# EAGLE schematic Main (EAGLE 7.7.0)
AUTHOR: Thomas D'Agostino; REV: 0.5

## Sheet 1 of 6: Control Input Protection
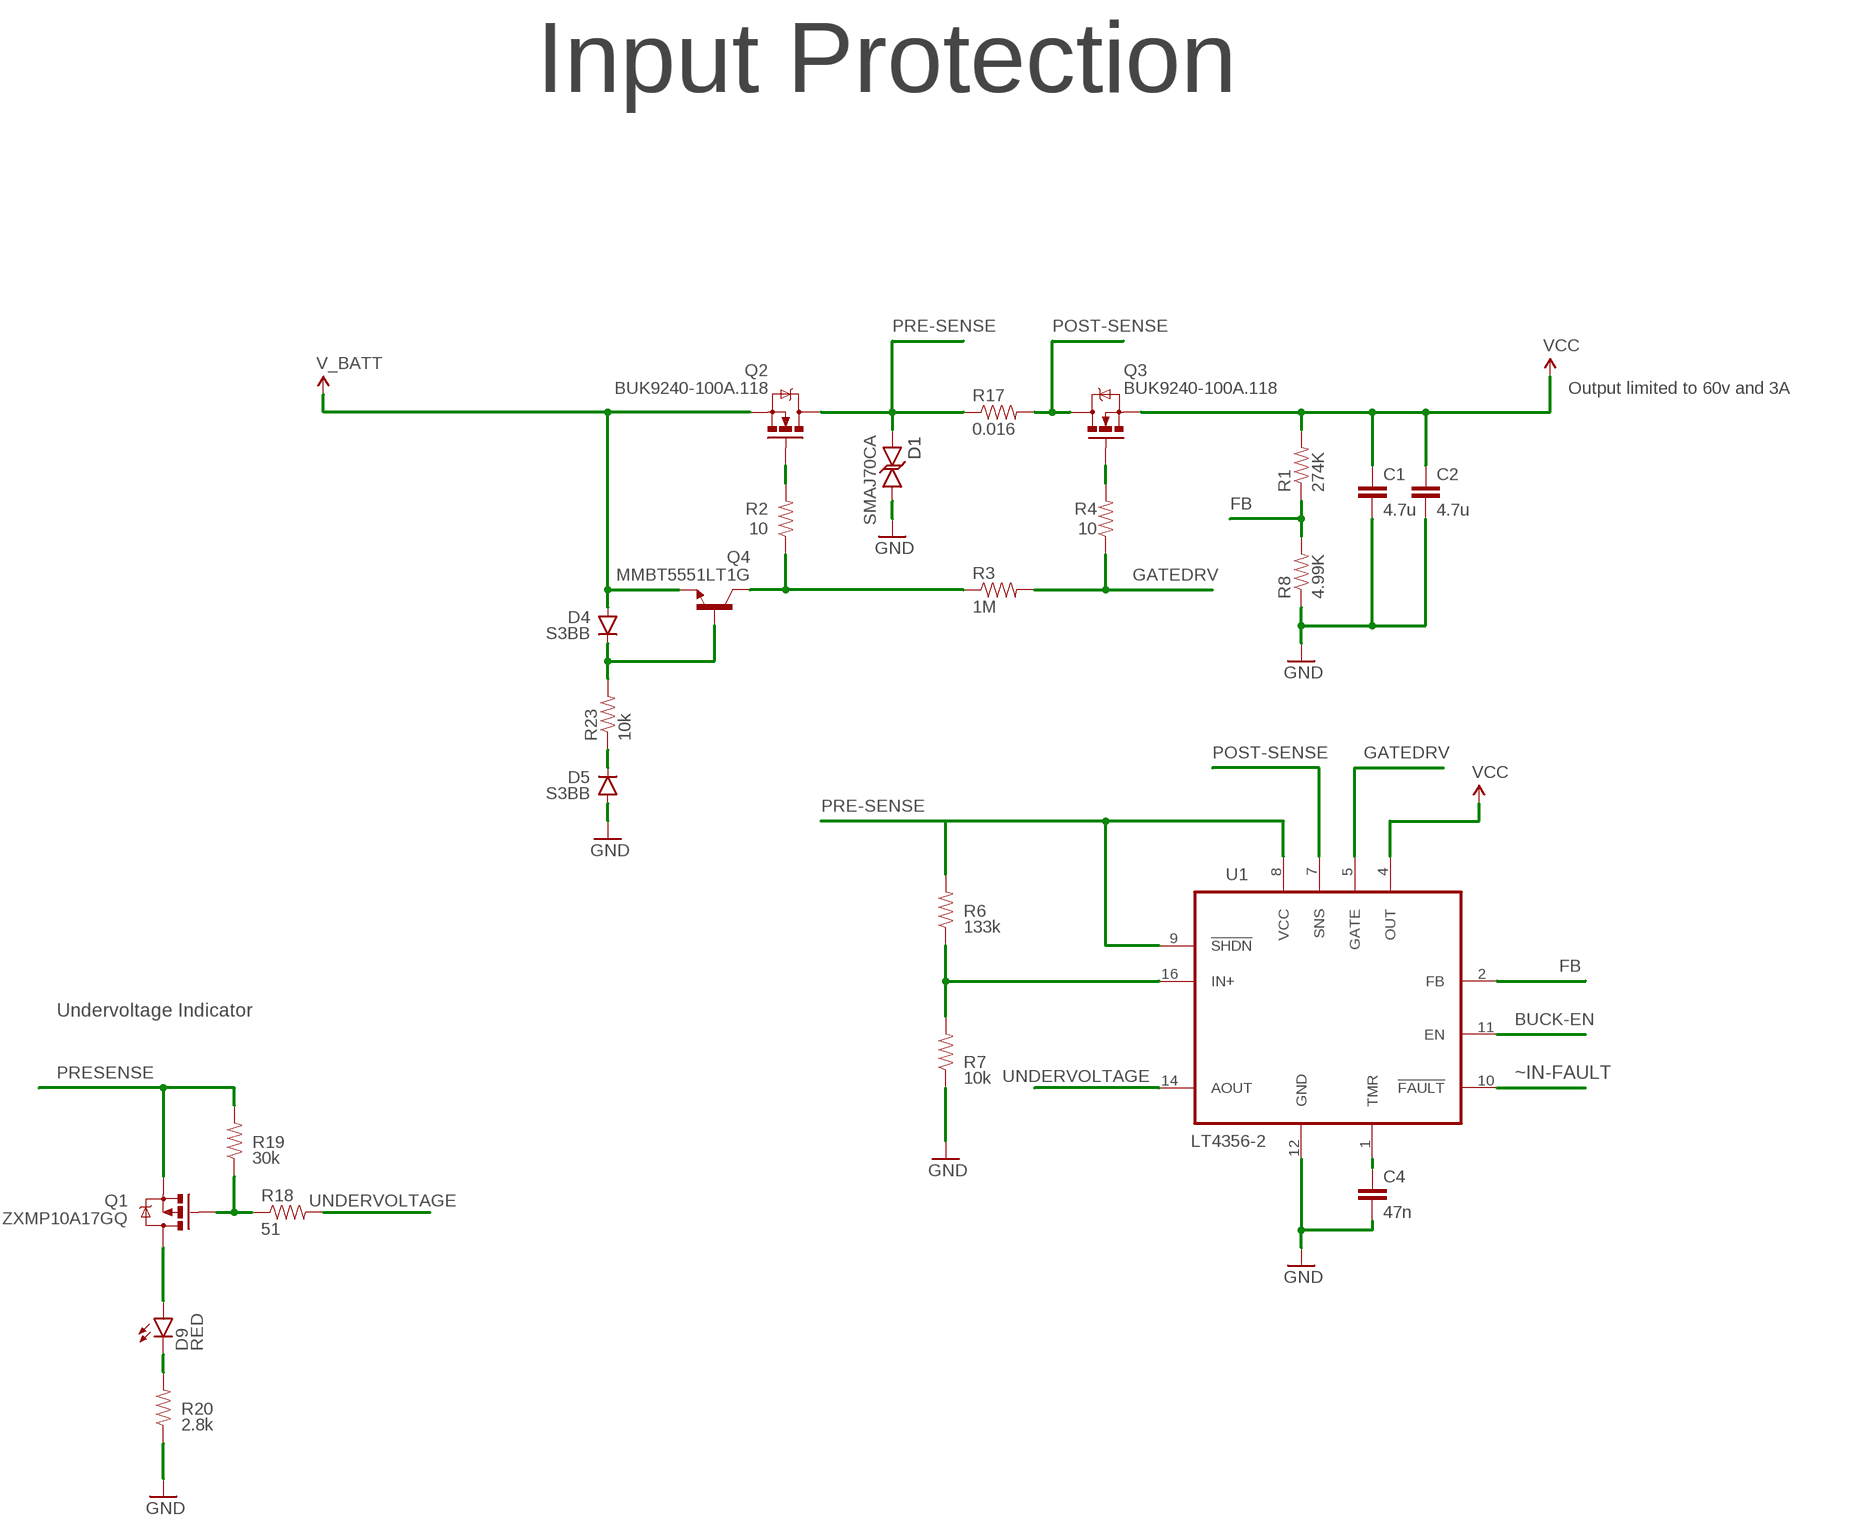
[diagram p0: schematic, sheet 1]

### Parts
C1  4.7u  CAP1210  [1210]
C2  4.7u  CAP1210  [1210]
C4  47n  CAP0805  [0805]
D1  SMAJ70CA  [SMA-DIODE]
D4  S3BB  DIODES3BB  [SMB-DIODE]
D5  S3BB  DIODES3BB  [SMB-DIODE]
D9  RED  LED-RED1206  [LED-1206]
Q1  ZXMP10A17GQ  MOSFET-PCHANNELZXMP10A17GQ  [SOT223]
Q2  BUK9240-100A.118  MOSFET-NCHANNELBUK9240-100A.118  [DPAK]
Q3  BUK9240-100A.118  MOSFET-NCHANNELBUK9240-100A.118  [DPAK]
Q4  MMBT5551LT1G  TRANSISTOR_NPNMMBT5551LT1G  [SOT23-3]
R1  274K  RESISTOR1206  [1206]
R2  10  RESISTOR1206  [1206]
R3  1M  RESISTOR0805-RES  [0805]
R4  10  RESISTOR0805-RES  [0805]
R6  133k  RESISTOR0805-RES  [0805]
R7  10k  RESISTOR0805-RES  [0805]
R8  4.99K  RESISTOR1206  [1206]
R17  0.016  RESISTOR2010  [R2010]
R18  51  RESISTOR1206  [1206]
R19  30k  RESISTOR1206  [1206]
R20  2.8k  RESISTOR1206  [1206]
R23  10k  RESISTOR1206  [1206]
U1  LT4356-2  [SOIC-16]

### Nets
BUCK-EN: U1.11(EN) ; also sheet 2
FB: R1.1 R8.2 U1.2(FB)
GATEDRV: R3.2 R4.1 U1.5(GATE)
GND: C1.2 C2.2 C4.2 D1.C D5.A R7.1 R8.1 R20.1 U1.12(GND) ; also sheet 2,3,4,5
N$1: C4.1 U1.1(TMR)
N$4: D9.C R20.2
N$7: Q2.1(G) R2.2
N$8: D4.A Q2.3(S) Q4.2(E)
N$9: D4.C Q4.1(B) R23.2
N$11: Q3.1(G) R4.2
N$13: R6.1 R7.2 U1.16(IN+)
N$19: Q1.1(G) R18.1 R19.1
N$20: Q4.3(C) R2.1 R3.1
N$22: D9.A Q1.2(D) Q1.4(D)
N$23: D5.C R23.1
POST-SENSE: Q3.4(D) R17.2 U1.7(SNS)
PRE-SENSE: D1.A Q2.4(D) R6.2 R17.1 U1.8(VCC) U1.9(!SHDN)
PRESENSE: Q1.3(S) R19.2
UNDERVOLTAGE: R18.2 U1.14(AOUT)
VCC: C1.1 C2.1 Q3.3(S) R1.2 U1.4(OUT) ; also sheet 2,3
~IN-FAULT: U1.10(!FAULT)

### Notes on the sheet
- Input Protection
- Output limited to 60v and 3A
- Undervoltage Indicator

## Sheet 2 of 6: Gate Driver
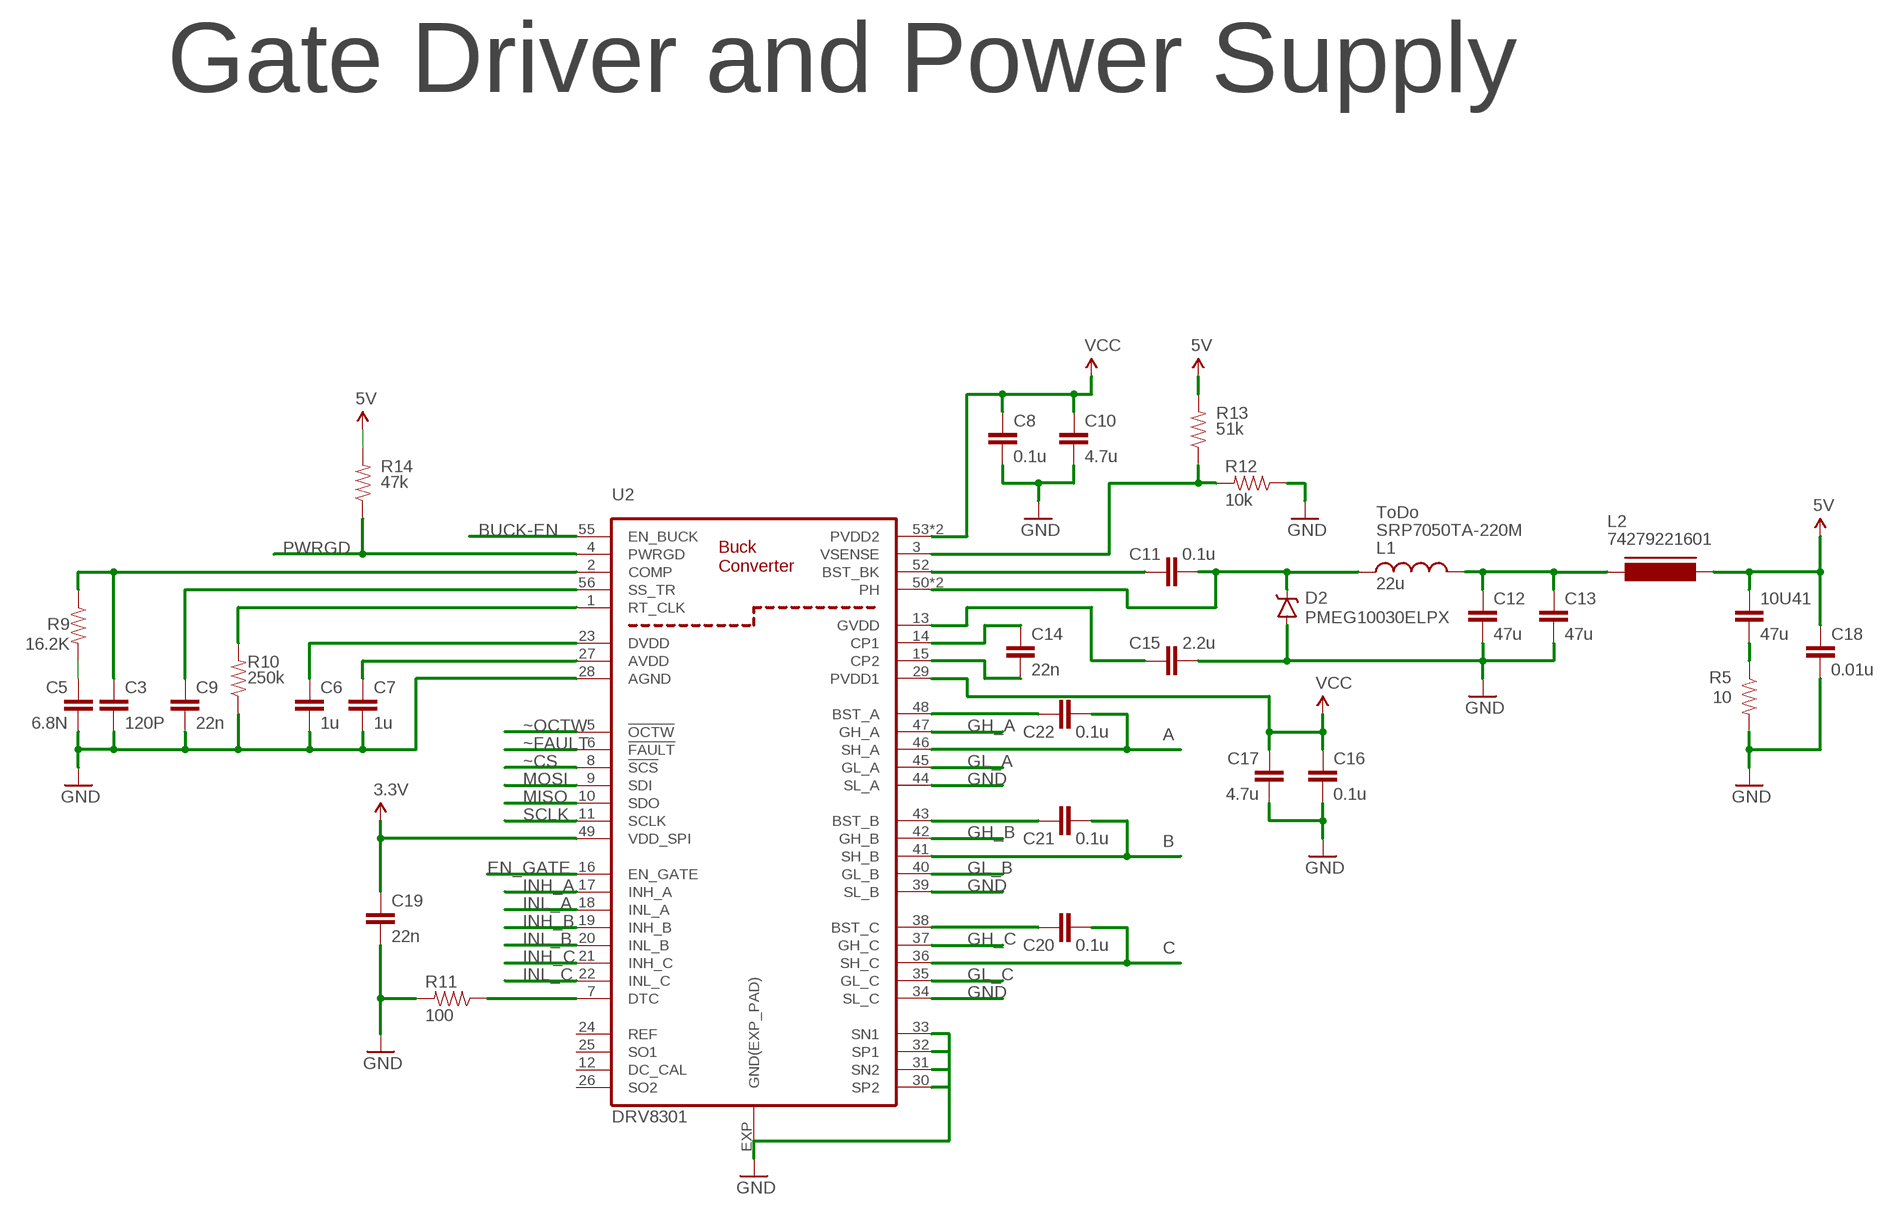
[diagram p1: schematic, sheet 2]

### Parts
10U41  47u  CAP1210  [1210]
C3  120P  CAP0805  [0805]
C5  6.8N  CAP0805  [0805]
C6  1u  CAP0805  [0805]
C7  1u  CAP0805  [0805]
C8  0.1u  CAP0805  [0805]
C9  22n  CAP0805  [0805]
C10  4.7u  CAP1210  [1210]
C11  0.1u  CAP0805  [0805]
C12  47u  CAP1210  [1210]
C13  47u  CAP1210  [1210]
C14  22n  CAP0805  [0805]
C15  2.2u  CAP1210  [1210]
C16  0.1u  CAP0805  [0805]
C17  4.7u  CAP1210  [1210]
C18  0.01u  CAP0805  [0805]
C19  22n  CAP0805  [0805]
C20  0.1u  CAP0805  [0805]
C21  0.1u  CAP0805  [0805]
C22  0.1u  CAP0805  [0805]
D2  PMEG10030ELPX  [SMB-DIODE]
L1  22u  INDUCTORPWR  [CDRH125]
L2  FERRITE-1206  [FB1206]
R5  10  RESISTOR0805-RES  [0805]
R9  16.2K  RESISTOR0805-RES  [0805]
R10  250k  RESISTOR0805-RES  [0805]
R11  100  RESISTOR0805-RES  [0805]
R12  10k  RESISTOR0805-RES  [0805]
R13  51k  RESISTOR0805-RES  [0805]
R14  47k  RESISTOR0805-RES  [0805]
U2  DRV8301  [HTSSOP_56]

### Nets
3.3V: C19.1 U2.49(VDD_SPI)
5V: 10U41.1 C18.1 L2.1 R13.2 R14.2 ; also sheet 3,5
A: C22.2 U2.46(SH_A) ; also sheet 4,5
B: C21.2 U2.41(SH_B) ; also sheet 4,5
BUCK-EN: U2.55(EN_BUCK) ; also sheet 1
C: C20.2 U2.36(SH_C) ; also sheet 4,5
EN_GATE: U2.16(EN_GATE) ; also sheet 3
GH_A: U2.47(GH_A) ; also sheet 4
GH_B: U2.42(GH_B) ; also sheet 4
GH_C: U2.37(GH_C) ; also sheet 4
GL_A: U2.45(GL_A) ; also sheet 4
GL_B: U2.40(GL_B) ; also sheet 4
GL_C: U2.35(GL_C) ; also sheet 4
GND: C3.2 C5.2 C6.2 C7.2 C8.2 C9.2 C10.2 C12.2 C13.2 C15.2 C16.2 C17.1 C18.2 C19.2 D2.A R5.2 R10.1 R11.2 R12.1 U2.28(AGND) U2.30(SP2) U2.31(SN2) U2.32(SP1) U2.33(SN1) U2.34(SL_C) U2.39(SL_B) U2.44(SL_A) U2.EXP(GND(EXP_PAD)) ; also sheet 1,3,4,5
INH_A: U2.17(INH_A) ; also sheet 3
INH_B: U2.19(INH_B) ; also sheet 3
INH_C: U2.21(INH_C) ; also sheet 3
INL_A: U2.18(INL_A) ; also sheet 3
INL_B: U2.20(INL_B) ; also sheet 3
INL_C: U2.22(INL_C) ; also sheet 3
MISO: U2.10(SDO) ; also sheet 3
MOSI: U2.9(SDI) ; also sheet 3
N$2: R10.2 U2.1(RT_CLK)
N$3: C5.1 R9.2
N$5: C6.1 U2.23(DVDD)
N$6: C3.1 R9.1 U2.2(COMP)
N$10: C7.1 U2.27(AVDD)
N$12: C9.1 U2.56(SS_TR)
N$14: R12.2 R13.1 U2.3(VSENSE)
N$15: C11.1 U2.52(BST_BK)
N$16: C11.2 D2.C L1.1 U2.50(PH) U2.51(PH)
N$17: C14.2 U2.15(CP2)
N$18: C14.1 U2.14(CP1)
N$21: C15.1 U2.13(GVDD)
N$24: C22.1 U2.48(BST_A)
N$25: C20.1 U2.38(BST_C)
N$26: R11.1 U2.7(DTC)
N$30: C21.1 U2.43(BST_B)
N$38: C12.1 C13.1 L1.2 L2.2
N$40: 10U41.2 R5.1
PWRGD: R14.1 U2.4(PWRGD)
SCLK: U2.11(SCLK) ; also sheet 3
VCC: C8.1 C10.1 C16.1 C17.2 U2.29(PVDD1) U2.53(PVDD2) U2.54(PVDD2) ; also sheet 1,3
~CS: U2.8(!SCS) ; also sheet 3
~FAULT: U2.6(!FAULT) ; also sheet 3
~OCTW: U2.5(!OCTW) ; also sheet 3
Unconnected: U2.12(DC_CAL) U2.24(REF) U2.25(SO1) U2.26(SO2)

### Notes on the sheet
- Gate Driver and Power Supply
- ToDo
- SRP7050TA-220M
- 74279221601

## Sheet 3 of 6: MCU
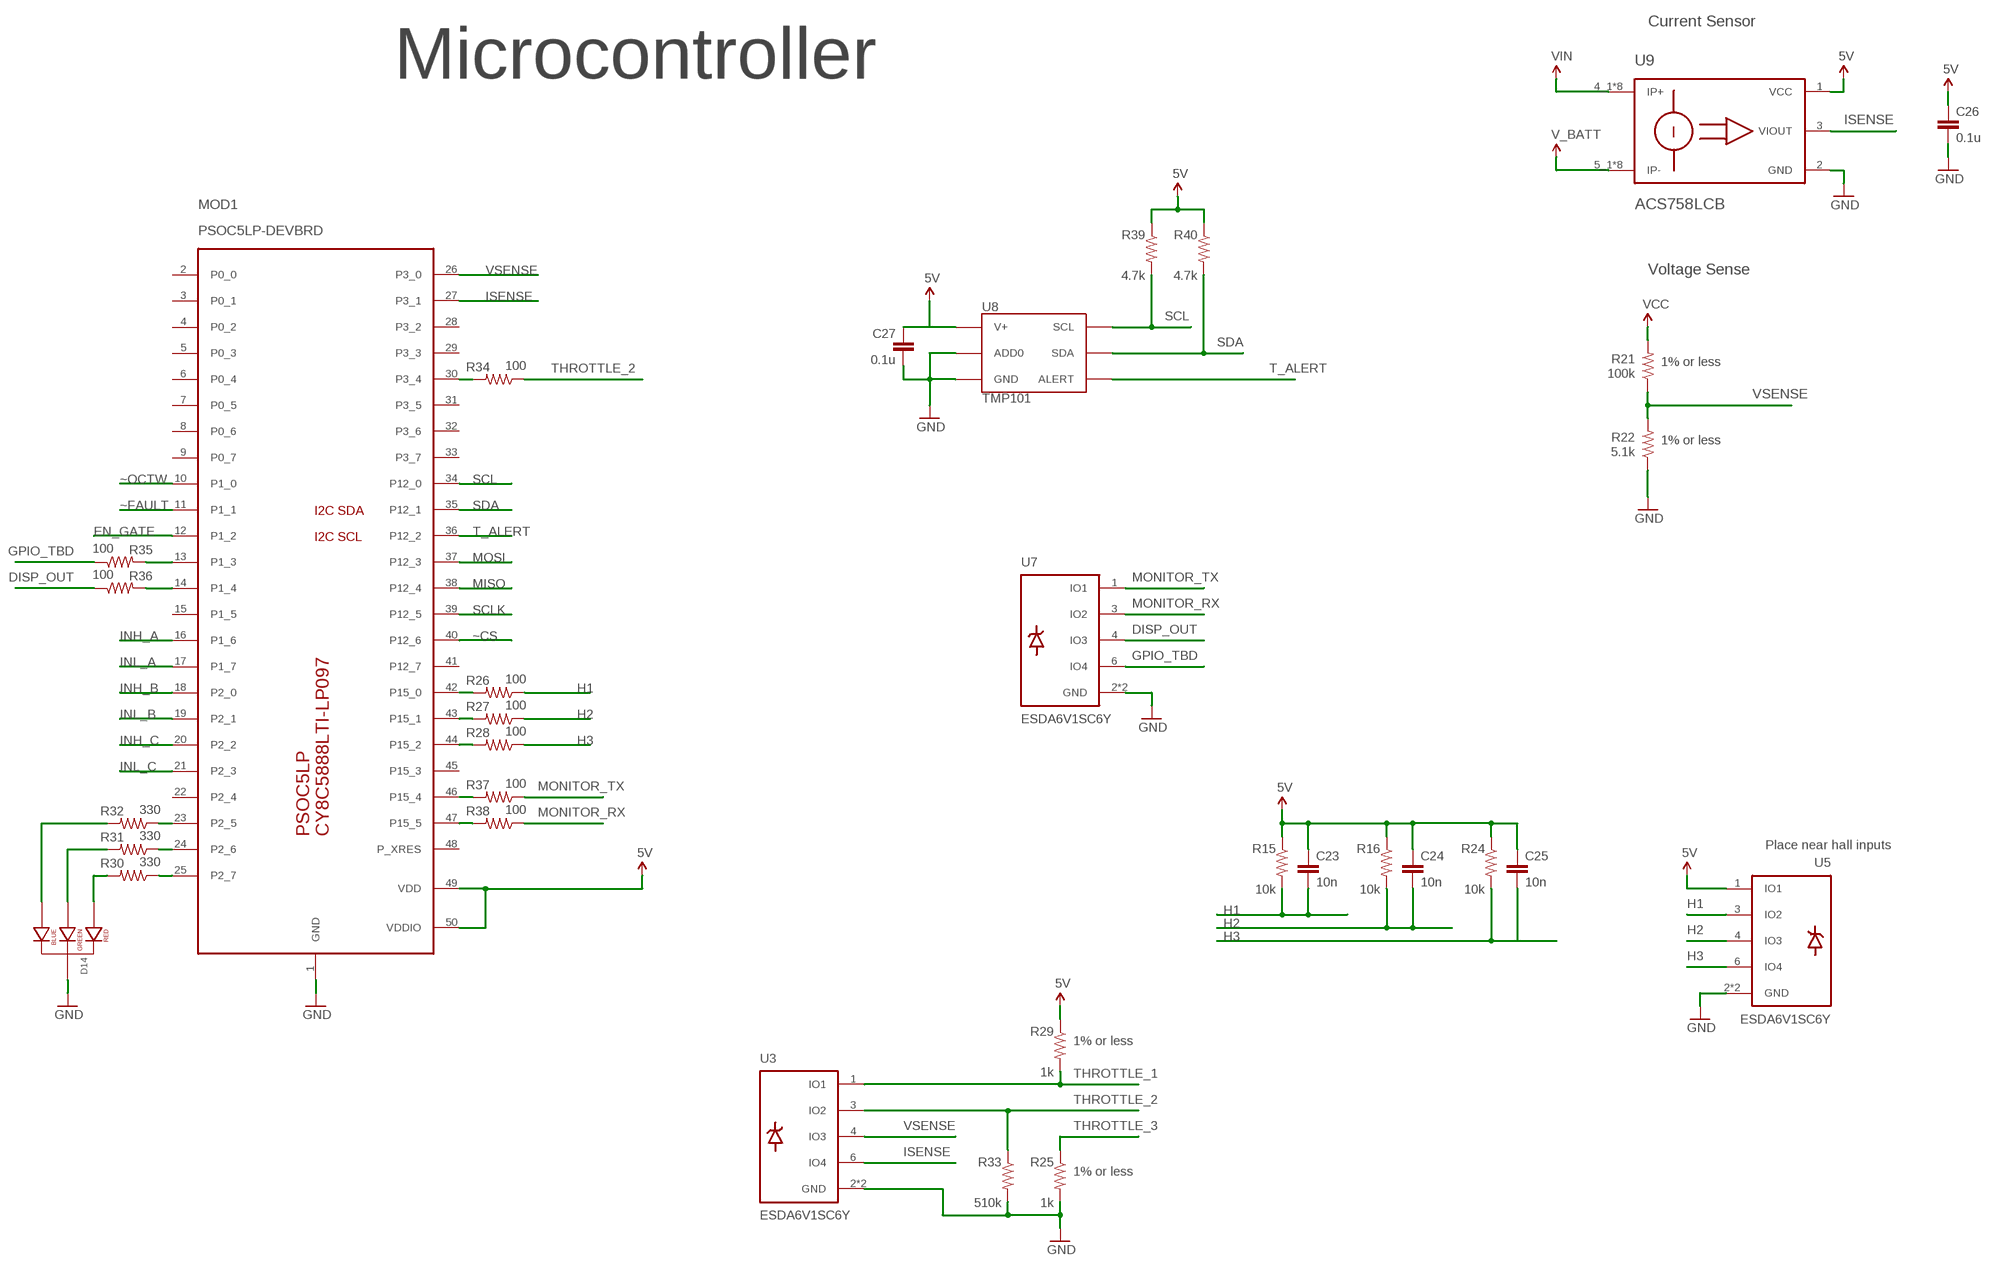
[diagram p2: schematic, sheet 3]

### Parts
C23  10n  CAP0805  [0805]
C24  10n  CAP0805  [0805]
C25  10n  CAP0805  [0805]
C26  0.1u  CAP0805  [0805]
C27  0.1u  CAP0805  [0805]
D14  LED-RGB-CC-THRUDIFFUSE  [LED-RGB-THRU]
MOD1  PSOC5LP-DEVBRD  [TQFP100]
R15  10k  RESISTOR0805-RES  [0805]
R16  10k  RESISTOR0805-RES  [0805]
R21  100k  RESISTOR1206  [1206]
R22  5.1k  RESISTOR1206  [1206]
R24  10k  RESISTOR0805-RES  [0805]
R25  1k  RESISTOR0805-RES  [0805]
R26  100  RESISTOR0805-RES  [0805]
R27  100  RESISTOR0805-RES  [0805]
R28  100  RESISTOR0805-RES  [0805]
R29  1k  RESISTOR0805-RES  [0805]
R30  330  RESISTOR0805-RES  [0805]
R31  330  RESISTOR0805-RES  [0805]
R32  330  RESISTOR0805-RES  [0805]
R33  510k  RESISTOR0805-RES  [0805]
R34  100  RESISTOR0805-RES  [0805]
R35  100  RESISTOR0805-RES  [0805]
R36  100  RESISTOR0805-RES  [0805]
R37  100  RESISTOR0805-RES  [0805]
R38  100  RESISTOR0805-RES  [0805]
R39  4.7k  RESISTOR0805-RES  [0805]
R40  4.7k  RESISTOR0805-RES  [0805]
U3  ESDA6V1SC6Y  [SOT23-6]
U5  ESDA6V1SC6Y  [SOT23-6]
U7  ESDA6V1SC6Y  [SOT23-6]
U8  TMP101  [SOT23-6]
U9  ACS758LCB  [CB5PIN]

### Nets
5V: C23.1 C24.1 C25.1 C26.1 C27.1 R15.1 R16.1 R24.1 R29.1 R39.1 R40.1 U5.1(IO1) U8.4(V+) U9.1(VCC) ; also sheet 2,5
DISP_OUT: R36.1 U7.4(IO3) ; also sheet 5
EN_GATE: MOD1.12(P1_2) ; also sheet 2
GND: C26.2 C27.2 D14.2(CATHODE) MOD1.1(GND) R22.1 R25.2 R33.2 U3.2(GND) U3.5(GND) U5.2(GND) U5.5(GND) U7.2(GND) U7.5(GND) U8.2(GND) U8.5(ADD0) U9.2(GND) ; also sheet 1,2,4,5
GPIO_TBD: R35.1 U7.6(IO4) ; also sheet 5
H1: C23.2 R15.2 R26.1 ; also sheet 5
H2: C24.2 R16.2 R27.1 ; also sheet 5
H3: C25.2 R24.2 R28.1 ; also sheet 5
ISENSE: MOD1.27(P3_1) U3.6(IO4) U9.3(VIOUT)
MONITOR_RX: R38.1 U7.3(IO2) ; also sheet 5
MONITOR_TX: R37.1 U7.1(IO1) ; also sheet 5
N$27: MOD1.42(P15_0) R26.2
N$28: MOD1.43(P15_1) R27.2
N$29: MOD1.44(P15_2) R28.2
N$31: MOD1.49(VDD) MOD1.50(VDDIO)
N$32: MOD1.25(P2_7) R30.1
N$33: MOD1.24(P2_6) R31.1
N$34: MOD1.23(P2_5) R32.1
N$35: D14.1(RED_CATHODE) R30.2
N$36: D14.3(GREEN_CATHODE) R31.2
N$37: D14.4(BLUE_CATHODE) R32.2
N$39: MOD1.30(P3_4) R34.2
N$41: MOD1.14(P1_4) R36.2
N$42: MOD1.13(P1_3) R35.2
N$43: MOD1.46(P15_4) R37.2
N$44: MOD1.47(P15_5) R38.2
SCL: MOD1.34(P12_0) R39.2 U8.1(SCL)
SDA: MOD1.35(P12_1) R40.2 U8.6(SDA)
T_ALERT: MOD1.36(P12_2) U8.3(ALERT)
THROTTLE_1: R29.2 U3.1(IO1) ; also sheet 5
THROTTLE_2: R33.1 R34.1 U3.3(IO2) ; also sheet 5
THROTTLE_3: R25.1 ; also sheet 5
V_BATT: U9.5_1(IP-) U9.5_2(IP-) U9.5_3(IP-) U9.5_4(IP-) U9.5_5(IP-) U9.5_6(IP-) U9.5_7(IP-) U9.5_8(IP-) ; also sheet 1,4
VCC: R21.2 ; also sheet 1,2
VIN: U9.4_1(IP+) U9.4_2(IP+) U9.4_3(IP+) U9.4_4(IP+) U9.4_5(IP+) U9.4_6(IP+) U9.4_7(IP+) U9.4_8(IP+) ; also sheet 5
VSENSE: MOD1.26(P3_0) R21.1 R22.2 U3.4(IO3)
Unconnected: MOD1.2(P0_0) MOD1.3(P0_1) MOD1.4(P0_2) MOD1.5(P0_3) MOD1.6(P0_4) MOD1.7(P0_5) MOD1.8(P0_6) MOD1.9(P0_7) MOD1.10(P1_0) MOD1.11(P1_1) MOD1.15(P1_5) MOD1.16(P1_6) MOD1.17(P1_7) MOD1.18(P2_0) MOD1.19(P2_1) MOD1.20(P2_2) MOD1.21(P2_3) MOD1.22(P2_4) MOD1.28(P3_2) MOD1.29(P3_3) MOD1.31(P3_5) MOD1.32(P3_6) MOD1.33(P3_7) MOD1.37(P12_3) MOD1.38(P12_4) MOD1.39(P12_5) MOD1.40(P12_6) MOD1.41(P12_7) MOD1.45(P15_3) MOD1.48(P_XRES) U5.3(IO2) U5.4(IO3) U5.6(IO4)

### Notes on the sheet
- Current Sensor
- Microcontroller
- Voltage Sense
- 1% or less
- 1% or less
- Place near hall inputs
- 1% or less
- 1% or less

## Sheet 4 of 6: Power Output
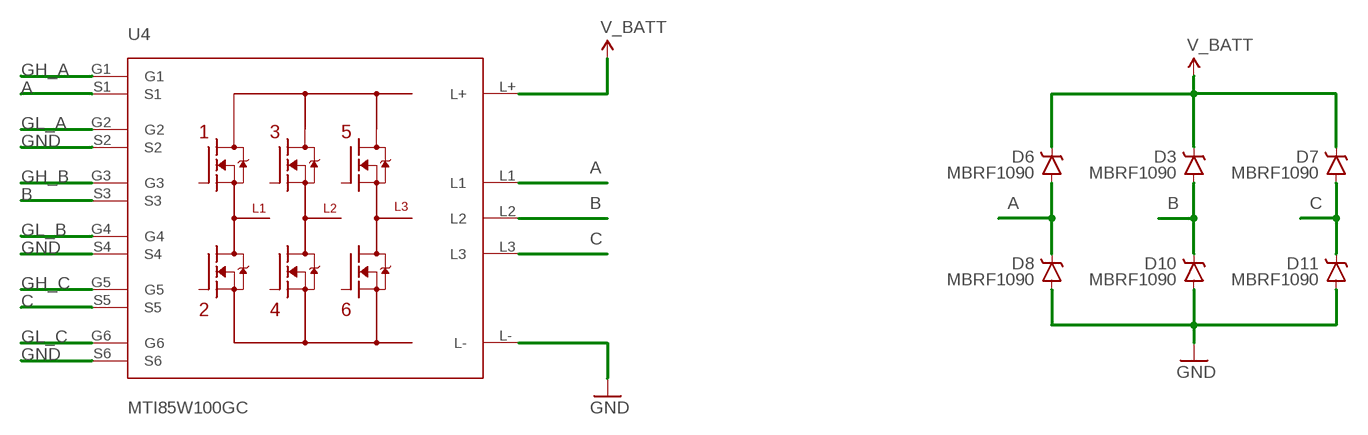
[diagram p3: schematic, sheet 4]

### Parts
D3  MBRF1090  DIODE-SCHOTTKYMBRF1090  [TO-220H_2]
D6  MBRF1090  DIODE-SCHOTTKYMBRF1090  [TO-220H_2]
D7  MBRF1090  DIODE-SCHOTTKYMBRF1090  [TO-220H_2]
D8  MBRF1090  DIODE-SCHOTTKYMBRF1090  [TO-220H_2]
D10  MBRF1090  DIODE-SCHOTTKYMBRF1090  [TO-220H_2]
D11  MBRF1090  DIODE-SCHOTTKYMBRF1090  [TO-220H_2]
U4  MTI85W100GC  [ISOPLUS-DIL]

### Nets
A: D6.2(A) D8.1(C) U4.L1 U4.S1 ; also sheet 2,5
B: D3.2(A) D10.1(C) U4.L2 U4.S3 ; also sheet 2,5
C: D7.2(A) D11.1(C) U4.L3 U4.S5 ; also sheet 2,5
GH_A: U4.G1 ; also sheet 2
GH_B: U4.G3 ; also sheet 2
GH_C: U4.G5 ; also sheet 2
GL_A: U4.G2 ; also sheet 2
GL_B: U4.G4 ; also sheet 2
GL_C: U4.G6 ; also sheet 2
GND: D8.2(A) D10.2(A) D11.2(A) U4.L- U4.S2 U4.S4 U4.S6 ; also sheet 1,2,3,5
V_BATT: D3.1(C) D6.1(C) D7.1(C) U4.L+ ; also sheet 1,3

## Sheet 5 of 6: Connectors
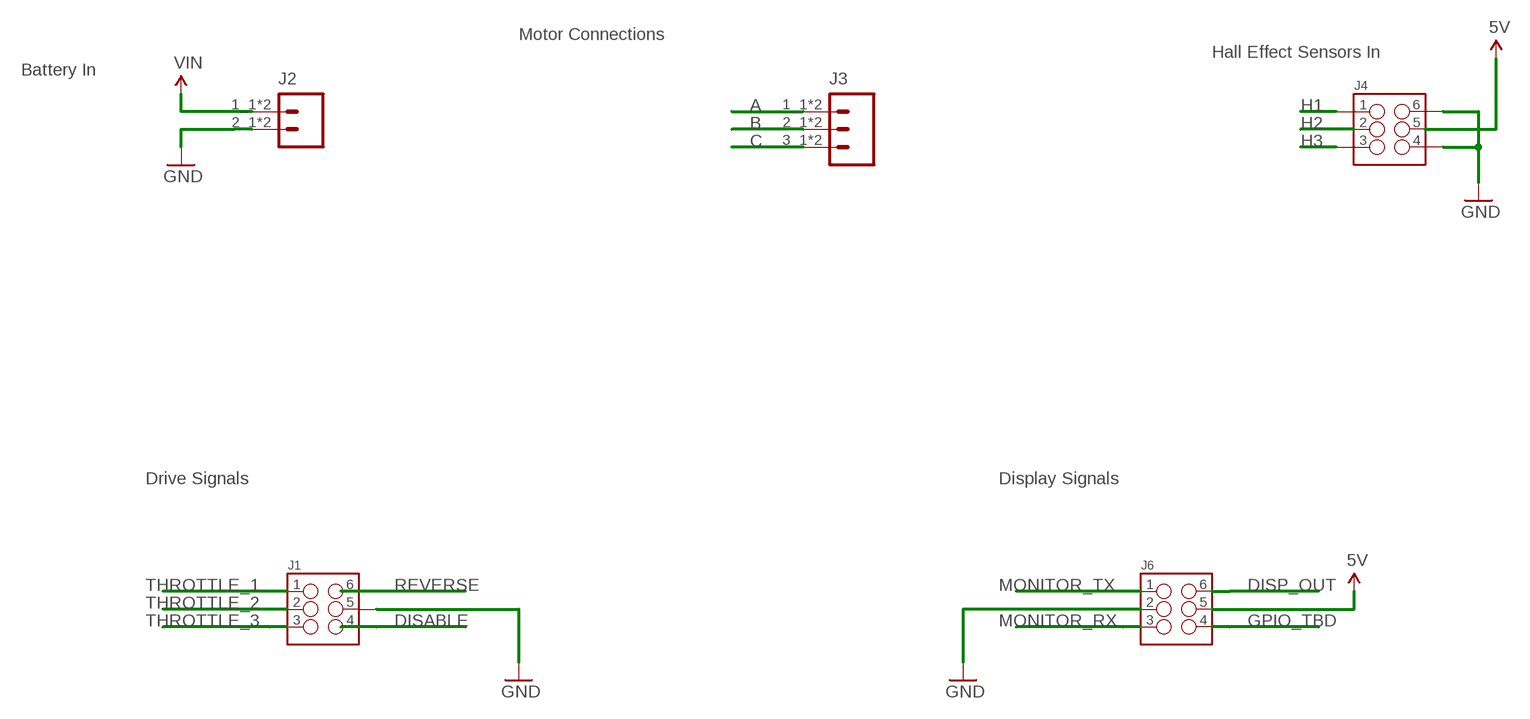
[diagram p4: schematic, sheet 5]

### Parts
J1  M03X2MINIFIT_JR  [2X03_MINIFIT_JR]
J2  M02MINIFIT-SR  [MINIFIT_SR]
J3  M03MINIFIT-SR3  [MINIFIT-SRX3]
J4  M03X2MINIFIT_JR  [2X03_MINIFIT_JR]
J6  M03X2MINIFIT_JR  [2X03_MINIFIT_JR]

### Nets
5V: J4.5 J6.5 ; also sheet 2,3
A: J3.1_1 J3.1_2 ; also sheet 2,4
B: J3.2_1 J3.2_2 ; also sheet 2,4
C: J3.3_1 J3.3_2 ; also sheet 2,4
DISABLE: J1.4
DISP_OUT: J6.6 ; also sheet 3
GND: J2.2_1 J2.2_2 J4.4 J4.6 J6.2 ; also sheet 1,2,3,4
GPIO_TBD: J6.4 ; also sheet 3
H1: J4.1 ; also sheet 3
H2: J4.2 ; also sheet 3
H3: J4.3 ; also sheet 3
MONITOR_RX: J6.3 ; also sheet 3
MONITOR_TX: J6.1 ; also sheet 3
REVERSE: J1.6
THROTTLE_1: J1.1 ; also sheet 3
THROTTLE_2: J1.2 ; also sheet 3
THROTTLE_3: J1.3 ; also sheet 3
VIN: J2.1_1 J2.1_2 ; also sheet 3
Unconnected: J1.5

### Notes on the sheet
- Motor Connections
- Hall Effect Sensors In
- Battery In
- Drive Signals | Display Signals

## Sheet 6 of 6: Mechanical
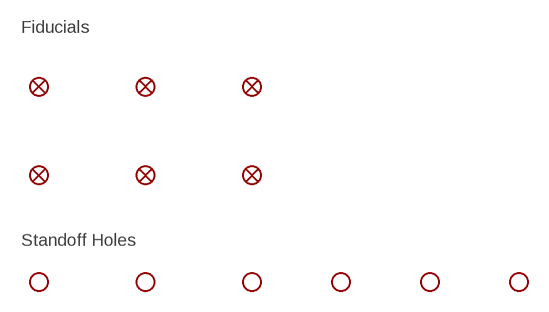
[diagram p5: schematic, sheet 6]

### Parts
FD1  FIDUCIAL1X2  [FIDUCIAL-1X2]
FD2  FIDUCIAL1X2  [FIDUCIAL-1X2]
FD3  FIDUCIAL1X2  [FIDUCIAL-1X2]
FD4  FIDUCIAL1X2  [FIDUCIAL-1X2]
FD5  FIDUCIAL1X2  [FIDUCIAL-1X2]
FD6  FIDUCIAL1X2  [FIDUCIAL-1X2]
H1  STAND-OFF  [STAND-OFF]
H2  STAND-OFF  [STAND-OFF]
H3  STAND-OFF  [STAND-OFF]
H4  STAND-OFF  [STAND-OFF]
H5  STAND-OFF  [STAND-OFF]
H6  STAND-OFF  [STAND-OFF]

### Notes on the sheet
- Fiducials
- Standoff Holes

## Library data of the parts
10U41 C3-C27 = SparkFun-Capacitors:CAP: Capacitor Standard 0603 ceramic capacitor, and 0.1" leaded capacitor.
C1 C2 = SparkFun-Passives:CAP: Capacitor Standard 0603 ceramic capacitor, and 0.1" leaded capacitor.
D1 = SparkFun-DiscreteSemi:SMAJ70CA: The SMAJ series is designed specifically to protect sensitive electronic equipment from voltage transients induced by lightning and other transient voltage events.
D2 = SparkFun-DiscreteSemi:PMEG10030ELPX
D3 D6-D8 D10 D11 = SparkFun-DiscreteSemi:DIODE-SCHOTTKY: Schottky diodes in SFE's production catalog BAT20J 1A 23V 0.62Vf RB751 120mA 40V 0.37Vf PMEG4005EJ 0.5A 40V 0.42Vf MBRA140 1A 40V 0.5Vf B340A 3A 40V SMA
D4 D5 = SparkFun-DiscreteSemi:DIODE: Diode These are standard reverse protection diodes and small signal diodes. SMA package can handle up to about 1A. SOD-323 can handle about 200mA. What the SOD-323 package when ordering, there are some mfgs out there that are 5-pin packages.
D9 = SparkFun-LED:LED-RED: Assorted Red LEDs LilyPad 1206- DIO-09912 1206- DIO-00809 0603- DIO-00819 "SMART" means more efficient and expensive; PROD_ID: DIO-09912
D14 = SparkFun-LED:LED-RGB-CC-THRU: RGB Through-hole common cathode LED SparkFun Storefront: COM-00105 (Clear) COM-09264 (Diffuse); PROD_ID: DIO-09434
FD1-FD6 = SparkFun-Aesthetics:FIDUCIAL: Fiducial Alignment Points Various fiducial points for machine vision alignment.
H1-H6 = SparkFun-Electromechanical:STAND-OFF: #4 Stand Off This is the mechanical footprint for a #4 phillips button head screw. Use the keepout ring to avoid running the screw head into surrounding components. SKU : PRT-00447
J1 J4 J6 = connectorsTVD:M03X2: 2x3 .1" header. Shrouded, with keying- CONN-10681 SMT- CONN-11415 Pogo pins- HW-11044
J2 = connectorsTVD:M02: Standard 2-pin 0.1" header. Use with - straight break away headers ( PRT-00116) - right angle break away headers (PRT-00553) - swiss pins (PRT-00743) - machine pins (PRT-00117) - female headers (PRT-00115) Molex polarized connector foot print use with: PRT-08233 with associated crimp pins and housings. 2.54_SCREWTERM for use with PRT-10571. 3.5mm Screw Terminal footprints for PRT-08084 5mm Screw Terminal footprints for use with PRT-08432
J3 = connectorsTVD:M03: Header 3 Standard 3-pin 0.1" header. Use with straight break away headers (SKU : PRT-00116), right angle break away headers (PRT-00553), swiss pins (PRT-00743), machine pins (PRT-00117), and female headers (PRT-00115). Molex polarized connector foot print use with SKU : PRT-08232 with associated crimp pins and housings.
L1 = SparkFun-Passives:INDUCTOR: Inductors Basic Inductor/Choke - 0603 and 1206. Footprints are not proven and vary greatly between part numbers. INDUCTOR POWER 3.3UH 4.0A SMD 0.197" L x 0.197" W x 0.177" H (5.00mm x 5.00mm x 4.50mm)
L2 = dp_devices.v6:FERRITE: Ferrite bead in various packages
MOD1 = modules:PSOC5LP-DEVBRD
Q1 = SparkFun-DiscreteSemi:MOSFET-PCHANNEL: Generic PMOSFET IRLML2244 - TRANS-11153 (SOT-23 -20V -4.3A) (1.Gate 2.Source 3.Drain) FQP27P06 - COM-10349 <http://www.sparkfun.com/products/10349> (TO-220 -60V -27A) (1.Gate 2.Source 3.Drain)
Q2 Q3 = SparkFun-DiscreteSemi:MOSFET-NCHANNEL: Common NMOSFET Parts MFG P/N Store ID Prod ID FDD8780 TRANS-09984 SI7820DN TRANS-11055 FDS6630A IC-08089 2N7002PW TRANS-11151 FQP30N06L COM-10213 TRANS-10060 BSS123LT1G TRANS-08345 BSS138 TRANS-00830 BS170 2N7000
Q4 = SparkFun-DiscreteSemi:TRANSISTOR_NPN: Generic NPN BJT MMBT2222A - TRANS-08049 (SOT-23, 1A 40V) MPSA42 - TRANS-09116 (SOT-23, 500mA 300V) MMBT5088LT1G - TRANS-11160 (SOT-23, 50 mA 30V) BC547 - COM-08928 <http://www.sparkfun.com/products/8928> (TO-92 45V 100mA) (1.Collector 2.Base 3.Emitter) 2N3904 - COM-00521 <http://www.sparkfun.com/products/521> (TO-92 40V 200mA) (1.Emitter 2.Base 3.Collector) P2N2222A - COM-12852 <http://www.sparkfun.com/products/12852> (TO-92 40V 600mA) (1.Collector 2.Base 3.Emitter)
R1-R22 R24-R40 = SparkFun-Resistors:RESISTOR: Resistor Basic schematic elements and footprints for 0603, 1206, and PTH resistors.
R23 = SparkFun-Passives:RESISTOR: Resistor Basic schematic elements and footprints for 0603, 1206, and PTH resistors.
U1 = IC:LT4356-2: The LT®4356 surge stopper protects loads from high voltage transients. It regulates the output during an overvoltage event, such as load dump in automobiles, by controlling the gate of an external N-channel MOSFET. The output is limited to a safe value thereby allowing the loads to continue functioning. The LT4356 also monitors the voltage drop between the VCC and SNS pins to protect against overcurrent faults. An internal amplifi er limits the current sense voltage to 50mV. In either fault condition, a timer is started inversely proportional to MOSFET stress. If the timer expires, the FLT pin pulls low to warn of an impending power down. If the condition persists, the MOSFET is turned off. After a cool down period, the GATE pin pulls up turning on the MOSFET again. The auxiliary amplifi er may be used as a voltage detection comparator or as a linear regulator controller driving an external PNP pass transistor. Back-to-back FETs can be used in lieu of a Schottky diode for reverse input protection, reducing voltage drop and power loss. A shutdown pin reduces the quiescent current to less than 7μA for the LT4356-1 during shutdown. The LT4356-2 differs from the LT4356-1 during shutdown by reducing the quiescent current to 60μA and keeping alive the auxiliary amplifi er for uses such as an undervoltage lockout or always-on regulator.
U2 = IC:DRV8301: The DRV8301 is a gate driver IC for three-phase motor drive applications. The device provides three half-bridge drivers, each capable of driving two Nchannel MOSFETs. The DRV8301 supports up to 1.7-A source and 2.3-A peak current capability. The DRV8301 can operate off of a single power supply with a wide range from 6-V to 60-V. The device uses a bootstrap gate driver architecture with trickle charge circuitry to support 100% duty cycle. The DRV8301 uses automatic handshaking when the high-side or low-side MOSFET is switching to prevent flow of current. Integrated VDS sensing of the high-side and low-side MOSFETs is used to protect the external power stage against overcurrent conditions. The DRV8301 includes two current shunt amplifiers for accurate current measurement. The amplifiers support bidirectional current sensing and provide an adjustable output offset up to 3 V. The DRV8301 also includes an integrated switching mode buck converter with adjustable output and switching frequency. The buck converter can provide up to 1.5 A to support MCU or additional system power needs. The SPI provides detailed fault reporting and flexible parameter settings such as gain options for the current shunt amplifiers and slew rate control of the gate drivers. Note: An automotive version exsists
U3 U5 U7 = IC:ESDA6V1SC6Y
U4 = IC:MTI85W100GC
U8 = SparkFun-DigitalIC:TMP101
U9 = IC:ACS758LCB